# EAGLE schematic Communication_Plug_USB_Micro_AB_FCI_10104111-0001LF (EAGLE 6.5.0)
Micro AB USB receptacle: FCI 10104111-0001LF Datasheet <http://portal.fciconnect.com/Comergent//fci/drawing/10104111.pdf> Surface Mount As per USB spec, the capacitance across the USB power lines must be between 1µf and 10µf. Use 5V_USB service and a load limiter like the FPF2123 if your board does not meet this specification or if you are unsure.
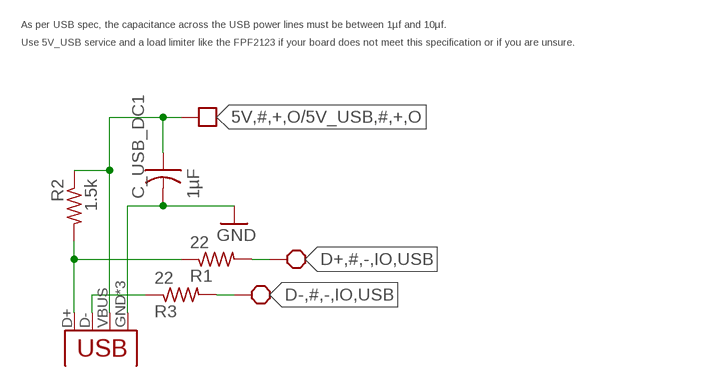
[diagram p0: schematic, sheet 1]

## Parts
C_USB_DC1  1µF  C-USC0603  [C0603]
R1  22  R-US_R0603  [R0603]
R2  1.5k  R-US_R0603  [R0603]
R3  22  R-US_R0603  [R0603]
X1  USB-MICROB  [USB-MICROB]

## Nets
5V,#,+,O/5V_USB,#,+,O: C_USB_DC1.1 R2.1 X1.VBUS ; supply symbol labelled BLOCK_OPTIONAL
D+,#,-,IO,USB: R1.2 ; supply symbol labelled BLOCK_REQUIREMENT
D+_IN_1: R1.1 R2.2 X1.D+
D-,#,-,IO,USB: R3.2 ; supply symbol labelled BLOCK_REQUIREMENT
D-_IN_1: R3.1 X1.D-
GND: C_USB_DC1.2 X1.GND X1.MT1(GND) X1.MT2(GND)

## Notes on the sheet
- As per USB spec, the capacitance across the USB power lines must be between 1µf and 10µf.
- Use 5V_USB service and a load limiter like the FPF2123 if your board does not meet this specification or if you are unsure.

## Library data of the parts
C_USB_DC1 = resistor:C-US: CAPACITOR, American symbol
R1-R3 = resistor:R-US_: RESISTOR, American symbol
X1 = SparkFun:USB: USB Connectors USB-B-PTH is fully proven SKU : PRT-00139 USB-miniB is fully proven SKU : PRT-00587 USB-A-PCB is untested. USB-A-H is throughly reviewed, but untested. Spark Fun Electronics SKU : PRT-00437 USB-B-SMT is throughly reviewed, but untested. Needs silkscreen touching up. USB-A-S has not been used/tested USB-MB-H has not been used/tested